# Altium schematic sheet USB_OTG.SchDoc
size A4
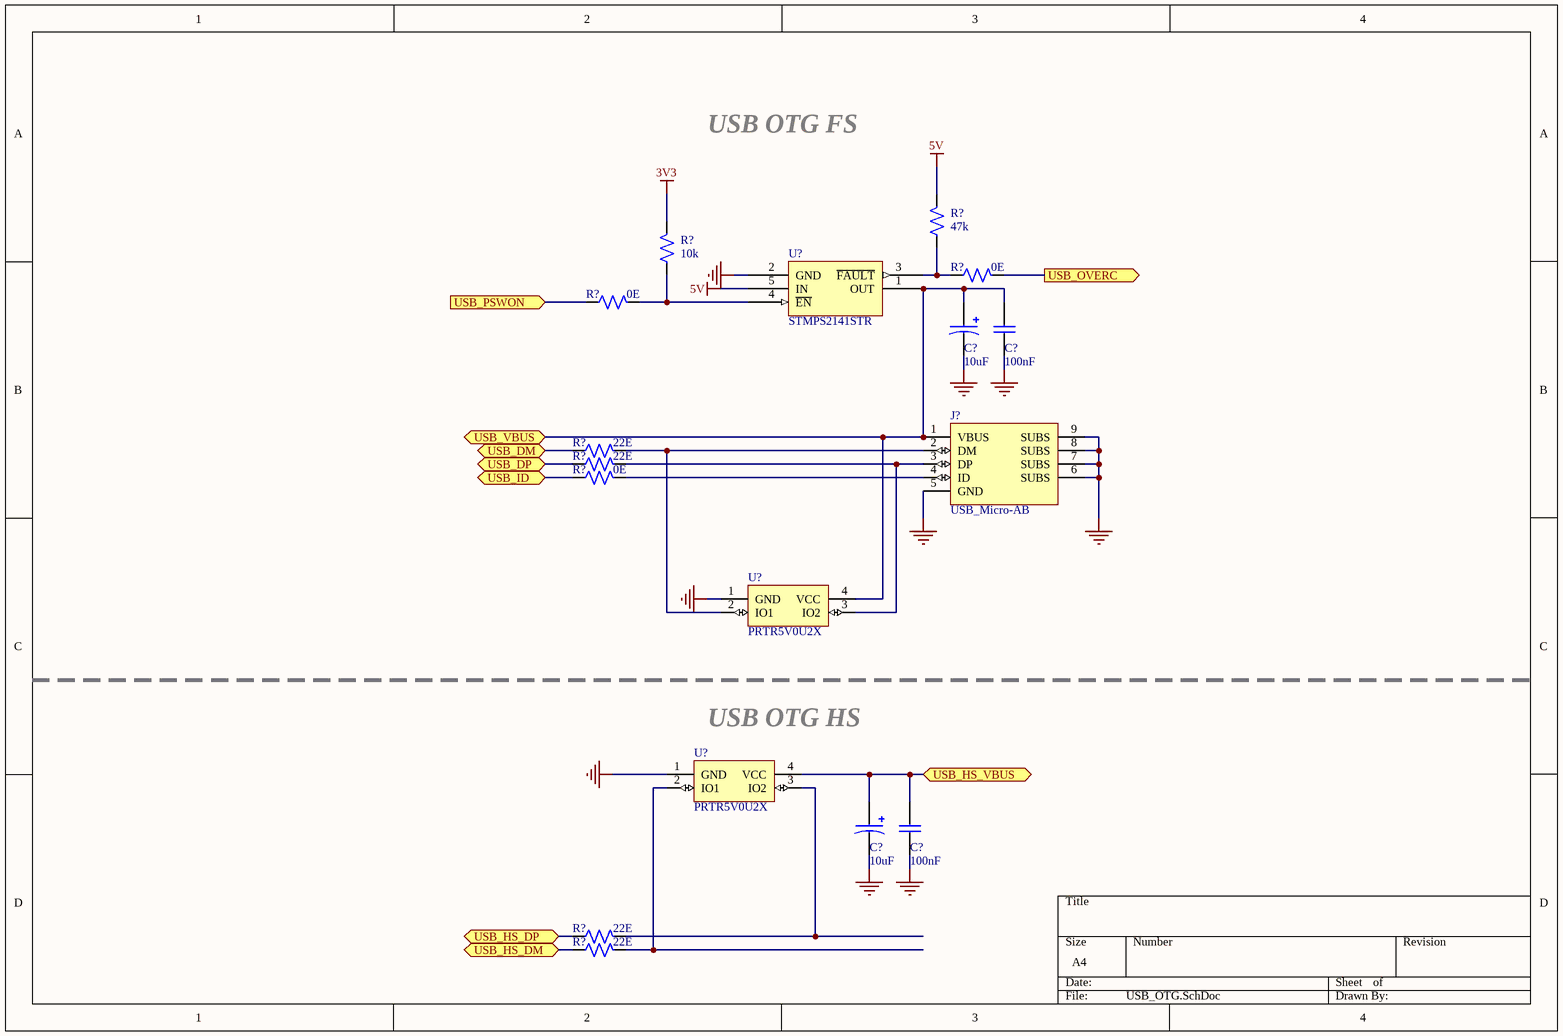
[diagram p0: USB_OTG.SchDoc]

## Parts
(Parts that share a designator on the sheet are numbered #1, #2 ... from top to bottom, then left to right.)
C?#1  Valor: 10uF  [AVX_C]  (hidden comment: 10uF 25V 10% T)
C?#2  Valor: 100nF  [C0603]  (hidden comment: 100nF 25V X7R)
C?#3  Valor: 10uF  [AVX_C]  (hidden comment: 10uF 25V 10% T)
C?#4  Valor: 100nF  [C0603]  (hidden comment: 100nF 25V X7R)
J?  USB_Micro-AB  [USB_Micro-AB]
R?#1  Valor: 47k  [R0603]  (hidden comment: 47k 5% 1/16W)
R?#2  Valor: 10k  [R0603]  (hidden comment: 10k 5% 1/16W)
R?#3  Valor: 0E  [R0603]  (hidden comment: 0E 5% 1/10W)
R?#4  Valor: 0E  [R0603]  (hidden comment: 0E 5% 1/10W)
R?#5  Valor: 22E  [R0603]  (hidden comment: 22E 5% 1/16W)
R?#6  Valor: 22E  [R0603]  (hidden comment: 22E 5% 1/16W)
R?#7  Valor: 0E  [R0603]  (hidden comment: 0E 5% 1/10W)
R?#8  Valor: 22E  [R0603]  (hidden comment: 22E 5% 1/16W)
R?#9  Valor: 22E  [R0603]  (hidden comment: 22E 5% 1/16W)
U?#1  STMPS2141STR  [SOT23-5L]
U?#2  PRTR5V0U2X  [SOT143B]
U?#3  PRTR5V0U2X  [SOT143B]

## Ports
USB_DM (bidir), USB_DP (bidir), USB_HS_DM (bidir), USB_HS_DP (bidir), USB_HS_VBUS (bidir), USB_ID (bidir), USB_OVERC (out), USB_PSWON (in), USB_VBUS

## Nets
3V3: R?#2.2
5V: R?#1.2 U?#1.5(IN)
NetC?#1_2: C?#1.2 C?#2.2 C?#3.2 C?#4.2 J?.5(GND) J?.6(SUBS) J?.7(SUBS) J?.8(SUBS) J?.9(SUBS) U?#1.2(GND) U?#2.1(GND) U?#3.1(GND)
USB_DM: R?#5.1 ; port USB_DM
USB_DP: R?#6.1 ; port USB_DP
USB_HS_DM: R?#9.1 ; port USB_HS_DM
USB_HS_DP: R?#8.1 ; port USB_HS_DP
USB_HS_VBUS: C?#3.1 C?#4.1 U?#3.4(VCC) ; port USB_HS_VBUS
USB_ID: R?#7.1 ; port USB_ID
USB_OVERC: R?#3.2 ; port USB_OVERC
USB_PSWON: R?#4.1 ; port USB_PSWON
USB_VBUS: C?#1.1 C?#2.1 J?.1(VBUS) U?#1.1(OUT) U?#2.4(VCC) ; port USB_VBUS
NetJ?_2: J?.2(DM) R?#5.2 U?#2.2(IO1)
NetJ?_3: J?.3(DP) R?#6.2 U?#2.3(IO2)
NetJ?_4: J?.4(ID) R?#7.2
NetR?#1_1: R?#1.1 R?#3.1 U?#1.3(~{FAULT})
NetR?#2_1: R?#2.1 R?#4.2 U?#1.4(~{EN})
NetR?#8_2: R?#8.2 U?#3.3(IO2)
NetR?#9_2: R?#9.2 U?#3.2(IO1)

## Notes on the sheet
- USB OTG FS
- (near U?#3) USB OTG HS

## Library data of the parts
C?#1 C?#3 = CapaPol: Capacitor polarizado
C?#2 C?#4 = Capacitor: Capacitor de placas paralelas
J? = USB_Micro-AB: Conector micro USB tipo AB
R?#1-R?#9 = Resistor: Resistencia
U?#1 = STMPS2141STR: Enhanced single channel power switch; Proveedor: Mouser; Cod. Proveedor: STMPS2141STR; Encapsulado: SOT23-5L
U?#2 U?#3 = PRTR5V0U2X: Ultra low capacitance double rail-to-rail ESD protection diode